# EAGLE design LED-Lamp-2-SMD-50leds (EAGLE 7.6.0)
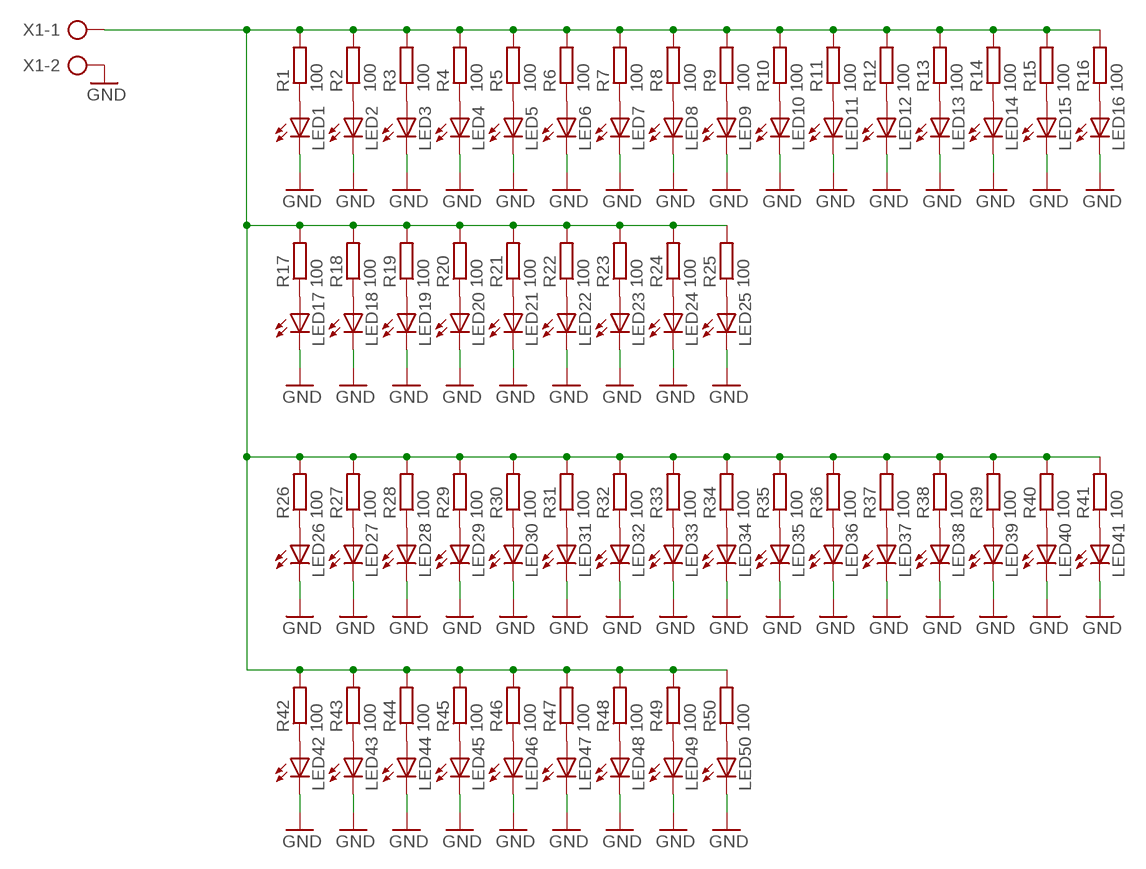
[diagram p0: schematic, sheet 1]

## Parts
LED1  LEDSML0805  [SML0805]
LED2  LEDSML0805  [SML0805]
LED3  LEDSML0805  [SML0805]
LED4  LEDSML0805  [SML0805]
LED5  LEDSML0805  [SML0805]
LED6  LEDSML0805  [SML0805]
LED7  LEDSML0805  [SML0805]
LED8  LEDSML0805  [SML0805]
LED9  LEDSML0805  [SML0805]
LED10  LEDSML0805  [SML0805]
LED11  LEDSML0805  [SML0805]
LED12  LEDSML0805  [SML0805]
LED13  LEDSML0805  [SML0805]
LED14  LEDSML0805  [SML0805]
LED15  LEDSML0805  [SML0805]
LED16  LEDSML0805  [SML0805]
LED17  LEDSML0805  [SML0805]
LED18  LEDSML0805  [SML0805]
LED19  LEDSML0805  [SML0805]
LED20  LEDSML0805  [SML0805]
LED21  LEDSML0805  [SML0805]
LED22  LEDSML0805  [SML0805]
LED23  LEDSML0805  [SML0805]
LED24  LEDSML0805  [SML0805]
LED25  LEDSML0805  [SML0805]
LED26  LEDSML0805  [SML0805]
LED27  LEDSML0805  [SML0805]
LED28  LEDSML0805  [SML0805]
LED29  LEDSML0805  [SML0805]
LED30  LEDSML0805  [SML0805]
LED31  LEDSML0805  [SML0805]
LED32  LEDSML0805  [SML0805]
LED33  LEDSML0805  [SML0805]
LED34  LEDSML0805  [SML0805]
LED35  LEDSML0805  [SML0805]
LED36  LEDSML0805  [SML0805]
LED37  LEDSML0805  [SML0805]
LED38  LEDSML0805  [SML0805]
LED39  LEDSML0805  [SML0805]
LED40  LEDSML0805  [SML0805]
LED41  LEDSML0805  [SML0805]
LED42  LEDSML0805  [SML0805]
LED43  LEDSML0805  [SML0805]
LED44  LEDSML0805  [SML0805]
LED45  LEDSML0805  [SML0805]
LED46  LEDSML0805  [SML0805]
LED47  LEDSML0805  [SML0805]
LED48  LEDSML0805  [SML0805]
LED49  LEDSML0805  [SML0805]
LED50  LEDSML0805  [SML0805]
R1  100  R-EU_M0805  [M0805]
R2  100  R-EU_M0805  [M0805]
R3  100  R-EU_M0805  [M0805]
R4  100  R-EU_M0805  [M0805]
R5  100  R-EU_M0805  [M0805]
R6  100  R-EU_M0805  [M0805]
R7  100  R-EU_M0805  [M0805]
R8  100  R-EU_M0805  [M0805]
R9  100  R-EU_M0805  [M0805]
R10  100  R-EU_M0805  [M0805]
R11  100  R-EU_M0805  [M0805]
R12  100  R-EU_M0805  [M0805]
R13  100  R-EU_M0805  [M0805]
R14  100  R-EU_M0805  [M0805]
R15  100  R-EU_M0805  [M0805]
R16  100  R-EU_M0805  [M0805]
R17  100  R-EU_M0805  [M0805]
R18  100  R-EU_M0805  [M0805]
R19  100  R-EU_M0805  [M0805]
R20  100  R-EU_M0805  [M0805]
R21  100  R-EU_M0805  [M0805]
R22  100  R-EU_M0805  [M0805]
R23  100  R-EU_M0805  [M0805]
R24  100  R-EU_M0805  [M0805]
R25  100  R-EU_M0805  [M0805]
R26  100  R-EU_M0805  [M0805]
R27  100  R-EU_M0805  [M0805]
R28  100  R-EU_M0805  [M0805]
R29  100  R-EU_M0805  [M0805]
R30  100  R-EU_M0805  [M0805]
R31  100  R-EU_M0805  [M0805]
R32  100  R-EU_M0805  [M0805]
R33  100  R-EU_M0805  [M0805]
R34  100  R-EU_M0805  [M0805]
R35  100  R-EU_M0805  [M0805]
R36  100  R-EU_M0805  [M0805]
R37  100  R-EU_M0805  [M0805]
R38  100  R-EU_M0805  [M0805]
R39  100  R-EU_M0805  [M0805]
R40  100  R-EU_M0805  [M0805]
R41  100  R-EU_M0805  [M0805]
R42  100  R-EU_M0805  [M0805]
R43  100  R-EU_M0805  [M0805]
R44  100  R-EU_M0805  [M0805]
R45  100  R-EU_M0805  [M0805]
R46  100  R-EU_M0805  [M0805]
R47  100  R-EU_M0805  [M0805]
R48  100  R-EU_M0805  [M0805]
R49  100  R-EU_M0805  [M0805]
R50  100  R-EU_M0805  [M0805]
X1  AK300/2  [AK300/2]

## Nets
GND: LED1.C LED2.C LED3.C LED4.C LED5.C LED6.C LED7.C LED8.C LED9.C LED10.C LED11.C LED12.C LED13.C LED14.C LED15.C LED16.C LED17.C LED18.C LED19.C LED20.C LED21.C LED22.C LED23.C LED24.C LED25.C LED26.C LED27.C LED28.C LED29.C LED30.C LED31.C LED32.C LED33.C LED34.C LED35.C LED36.C LED37.C LED38.C LED39.C LED40.C LED41.C LED42.C LED43.C LED44.C LED45.C LED46.C LED47.C LED48.C LED49.C LED50.C X1.2
N$1: LED1.A R1.1
N$2: LED26.A R26.1
N$3: LED27.A R27.1
N$4: LED2.A R2.1
N$5: R1.2 R2.2 R3.2 R4.2 R5.2 R6.2 R7.2 R8.2 R9.2 R10.2 R11.2 R12.2 R13.2 R14.2 R15.2 R16.2 R17.2 R18.2 R19.2 R20.2 R21.2 R22.2 R23.2 R24.2 R25.2 R26.2 R27.2 R28.2 R29.2 R30.2 R31.2 R32.2 R33.2 R34.2 R35.2 R36.2 R37.2 R38.2 R39.2 R40.2 R41.2 R42.2 R43.2 R44.2 R45.2 R46.2 R47.2 R48.2 R49.2 R50.2 X1.1
N$6: LED3.A R3.1
N$7: LED28.A R28.1
N$8: LED4.A R4.1
N$9: LED29.A R29.1
N$10: LED5.A R5.1
N$11: LED31.A R31.1
N$12: LED6.A R6.1
N$13: LED30.A R30.1
N$14: LED7.A R7.1
N$15: LED32.A R32.1
N$16: LED8.A R8.1
N$17: LED33.A R33.1
N$18: LED9.A R9.1
N$19: LED34.A R34.1
N$20: LED10.A R10.1
N$21: LED35.A R35.1
N$22: LED11.A R11.1
N$23: LED36.A R36.1
N$24: LED12.A R12.1
N$25: LED37.A R37.1
N$26: LED13.A R13.1
N$27: LED38.A R38.1
N$28: LED14.A R14.1
N$29: LED39.A R39.1
N$30: LED15.A R15.1
N$31: LED41.A R41.1
N$32: LED16.A R16.1
N$33: LED40.A R40.1
N$34: LED17.A R17.1
N$35: LED42.A R42.1
N$36: LED18.A R18.1
N$37: LED43.A R43.1
N$38: LED19.A R19.1
N$39: LED44.A R44.1
N$40: LED20.A R20.1
N$41: LED45.A R45.1
N$42: LED21.A R21.1
N$43: LED46.A R46.1
N$44: LED22.A R22.1
N$45: LED47.A R47.1
N$46: LED23.A R23.1
N$47: LED48.A R48.1
N$48: LED24.A R24.1
N$49: LED49.A R49.1
N$50: LED25.A R25.1
N$51: LED50.A R50.1

## Library data of the parts
LED1-LED50 = led:LED: LED OSRAM: - CHIPLED LG R971, LG N971, LY N971, LG Q971, LY Q971, LO R971, LY R971 LH N974, LH R974 LS Q976, LO Q976, LY Q976 LO Q996 - Hyper CHIPLED LW Q18S LB Q993, LB Q99A, LB R99A - SideLED LS A670, LO A670, LY A670, LG A670, LP A670 LB A673, LV A673, LT A673, LW A673 LH A674 LY A675 LS A676, LA A676, LO A676, LY A676, LW A676 LS A679, LY A679, LG A679 - Hyper Micro SIDELED® LS Y876, LA Y876, LO Y876, LY Y876 LT Y87S - SmartLED LW L88C, LW L88S LB L89C, LB L89S, LG L890 LS L89K, LO L89K, LY L89K LS L896, LA L896, LO L896, LY L896 - TOPLED LS T670, LO T670, LY T670, LG T670, LP T670 LSG T670, LSP T670, LSY T670, LOP T670, LYG T670 LG T671, LOG T671, LSG T671 LB T673, LV T673, LT T673, LW T673 LH T674 LS T676, LA T676, LO T676, LY T676, LB T676, LH T676, LSB T676, LW T676 LB T67C, LV T67C, LT T67C, LS T67K, LO T67K, LY T67K, LW E67C LS E67B, LA E67B, LO E67B, LY E67B, LB E67C, LV E67C, LT E67C LW T67C LS T679, LY T679, LG T679 LS T770, LO T770, LY T770, LG T770, LP T770 LB T773, LV T773, LT T773, LW T773 LH T774 LS E675, LA E675, LY E675, LS T675 LS T776, LA T776, LO T776, LY T776, LB T776 LHGB T686 LT T68C, LB T68C - Hyper Mini TOPLED® LB M676 - Mini TOPLED Santana® LG M470 LS M47K, LO M47K, LY M47K Source: http://www.osram.convergy.de LUXEON: - LUMILED® LXK2-PW12-R00, LXK2-PW12-S00, LXK2-PW14-U00, LXK2-PW14-V00 LXK2-PM12-R00, LXK2-PM12-S00, LXK2-PM14-U00 LXK2-PE12-Q00, LXK2-PE12-R00, LXK2-PE12-S00, LXK2-PE14-T00, LXK2-PE14-U00 LXK2-PB12-K00, LXK2-PB12-L00, LXK2-PB12-M00, LXK2-PB14-N00, LXK2-PB14-P00, LXK2-PB14-Q00 LXK2-PR12-L00, LXK2-PR12-M00, LXK2-PR14-Q00, LXK2-PR14-R00 LXK2-PD12-Q00, LXK2-PD12-R00, LXK2-PD12-S00 LXK2-PH12-R00, LXK2-PH12-S00 LXK2-PL12-P00, LXK2-PL12-Q00, LXK2-PL12-R00 Source: www.luxeon.com KINGBRIGHT: KA-3528ASYC Source: www.kingbright.com
R1-R50 = rcl:R-EU_: RESISTOR, European symbol
X1 = con-ptr500:AK300/2: CONNECTOR; OC_FARNELL: unknown; OC_NEWARK: unknown

## Board
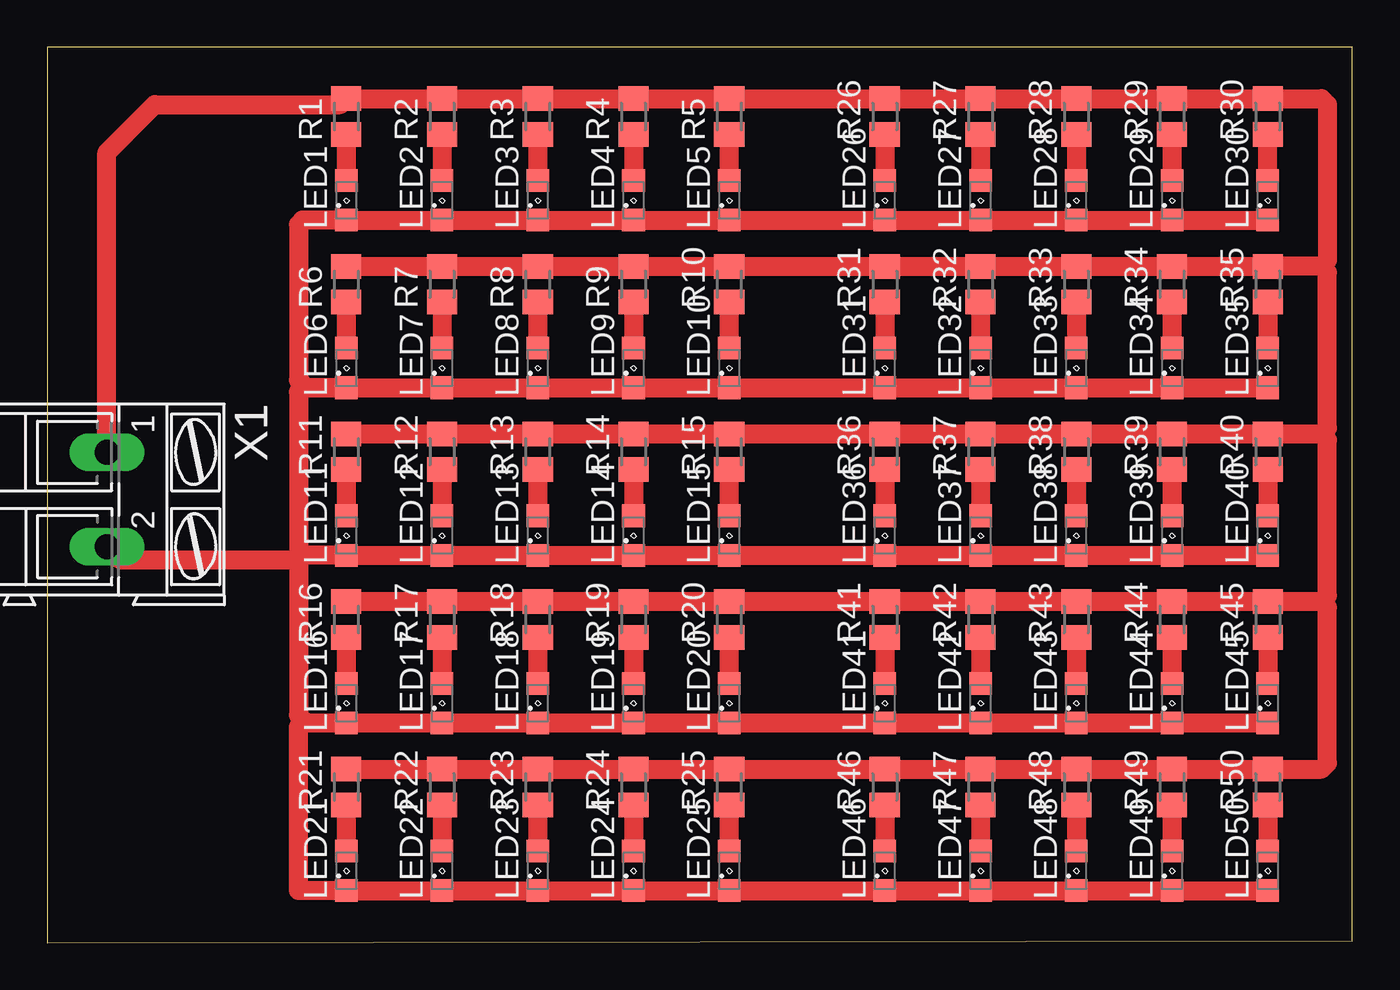
[diagram p1: board, top side]

Size 69.27 x 47.5 mm. Coordinates in mm from the lower left corner, seen from the top.
Outline: 0,0 69.27,0.1 69.27,47.5 0,47.5 0,0
Copper layers (1*16): Top 0.035mm / dielectric 1.5mm / Bottom 0.035mm
Design rules "default": minimum track width 10mil, minimum drill 24mil, track to track 8mil, track to pad 8mil, pad to pad 8mil, via to via 8mil, smd to smd 8mil, copper to edge 40mil, drill to drill 8mil, minimum pad ring 10mil, minimum via ring 8mil, stop-mask expansion 4mil, vias tented up to drill 0mil, thermal gap 10mil

### Footprints (pad centres in the part's own frame; a part is rotated, then mirrored left to right if it is on the bottom)
SML0805 = smd 1.2 x 1.2: A 1.05,0; C -1.05,0
M0805 = smd 1.3 x 1.6: 1 -0.95,0; 2 0.95,0
AK300/2 = drill 1.321 long: 1 -2.515,0; 2 2.489,0

### Placement (x,y rotation side)
LED1  15.88,39.37 90 top
LED2  20.95,39.37 90 top
LED3  26.04,39.37 90 top
LED4  31.11,39.37 90 top
LED5  36.2,39.37 90 top
LED6  15.88,30.48 90 top
LED7  20.95,30.48 90 top
LED8  26.04,30.48 90 top
LED9  31.11,30.48 90 top
LED10  36.2,30.48 90 top
LED11  15.88,21.59 90 top
LED12  20.95,21.59 90 top
LED13  26.04,21.59 90 top
LED14  31.11,21.59 90 top
LED15  36.2,21.59 90 top
LED16  15.88,12.7 90 top
LED17  20.95,12.7 90 top
LED18  26.04,12.7 90 top
LED19  31.11,12.7 90 top
LED20  36.2,12.7 90 top
LED21  15.88,3.81 90 top
LED22  20.95,3.81 90 top
LED23  26.04,3.81 90 top
LED24  31.11,3.81 90 top
LED25  36.2,3.81 90 top
LED26  44.45,39.37 90 top
LED27  49.53,39.37 90 top
LED28  54.61,39.37 90 top
LED29  59.69,39.37 90 top
LED30  64.77,39.37 90 top
LED31  44.45,30.48 90 top
LED32  49.53,30.48 90 top
LED33  54.61,30.48 90 top
LED34  59.69,30.48 90 top
LED35  64.77,30.48 90 top
LED36  44.45,21.59 90 top
LED37  49.53,21.59 90 top
LED38  54.61,21.59 90 top
LED39  59.69,21.59 90 top
LED40  64.77,21.59 90 top
LED41  44.45,12.7 90 top
LED42  49.53,12.7 90 top
LED43  54.61,12.7 90 top
LED44  59.69,12.7 90 top
LED45  64.77,12.7 90 top
LED46  44.45,3.81 90 top
LED47  49.53,3.81 90 top
LED48  54.61,3.81 90 top
LED49  59.69,3.81 90 top
LED50  64.77,3.81 90 top
R1  15.88,43.81 90 top
R2  20.95,43.81 90 top
R3  26.04,43.81 90 top
R4  31.11,43.81 90 top
R5  36.2,43.81 90 top
R6  15.88,34.92 90 top
R7  20.95,34.92 90 top
R8  26.04,34.92 90 top
R9  31.11,34.92 90 top
R10  36.2,34.92 90 top
R11  15.88,26.04 90 top
R12  20.95,26.04 90 top
R13  26.04,26.04 90 top
R14  31.11,26.04 90 top
R15  36.2,26.04 90 top
R16  15.88,17.14 90 top
R17  20.95,17.14 90 top
R18  26.04,17.14 90 top
R19  31.11,17.14 90 top
R20  36.2,17.14 90 top
R21  15.88,8.26 90 top
R22  20.95,8.26 90 top
R23  26.04,8.26 90 top
R24  31.11,8.26 90 top
R25  36.2,8.26 90 top
R26  44.45,43.81 90 top
R27  49.53,43.81 90 top
R28  54.61,43.81 90 top
R29  59.69,43.81 90 top
R30  64.77,43.81 90 top
R31  44.45,34.92 90 top
R32  49.53,34.92 90 top
R33  54.61,34.92 90 top
R34  59.69,34.92 90 top
R35  64.77,34.92 90 top
R36  44.45,26.04 90 top
R37  49.53,26.04 90 top
R38  54.61,26.04 90 top
R39  59.69,26.04 90 top
R40  64.77,26.04 90 top
R41  44.45,17.14 90 top
R42  49.53,17.14 90 top
R43  54.61,17.14 90 top
R44  59.69,17.14 90 top
R45  64.77,17.14 90 top
R46  44.45,8.26 90 top
R47  49.53,8.26 90 top
R48  54.61,8.26 90 top
R49  59.69,8.26 90 top
R50  64.77,8.26 90 top
X1  3.17,23.5 270 top

### Tracks (layer width: path | path; a pad name or v marks a point on that pad's centre or on a via)
GND
  Top 1.016: LED50.C LED49.C LED48.C LED47.C LED46.C LED25.C LED24.C LED23.C LED22.C LED21.C 13.34,2.76 13.34,11.43 13.65,11.75 | LED45.C LED44.C LED43.C LED42.C LED41.C LED20.C LED19.C LED18.C LED17.C LED16.C 13.75,11.65 13.65,11.75 | LED40.C LED39.C LED38.C LED37.C LED36.C LED15.C LED14.C LED13.C LED12.C LED11.C 13.34,20.54 | LED35.C LED34.C LED33.C LED32.C LED31.C LED10.C LED9.C LED8.C LED7.C LED6.C | LED30.C LED29.C LED28.C LED27.C LED26.C LED5.C LED4.C LED3.C LED2.C LED1.C 13.55,38.32 13.34,38.1 13.34,29.84 13.75,29.43 LED6.C | 13.34,20.54 13.34,20.32 | 13.34,20.32 13.34,12.06 13.65,11.75 | LED6.C 13.55,29.43 13.34,29.21 13.34,20.54 | X1.2 3.86,20.32 13.34,20.32
N$1
  Top 1.016: R1.1 LED1.A
N$2
  Top 1.016: R26.1 LED26.A
N$3
  Top 1.016: R27.1 LED27.A
N$4
  Top 1.016: R2.1 LED2.A
N$5
  Top 1.016: R6.2 R7.2 R8.2 R9.2 R10.2 R31.2 R32.2 R33.2 R34.2 R35.2 67.62,35.88 | R11.2 R12.2 R13.2 R14.2 R15.2 R36.2 R37.2 R38.2 R39.2 R40.2 67.62,26.98 | R16.2 R17.2 R18.2 R19.2 R20.2 R41.2 R42.2 R43.2 R44.2 R45.2 67.62,18.09 | R21.2 R22.2 R23.2 R24.2 R25.2 R46.2 R47.2 R48.2 R49.2 R50.2 67.62,9.21 67.94,9.53 67.94,17.77 67.62,18.09 | 67.62,35.88 67.94,36.2 67.94,44.45 67.63,44.77 R30.2 R29.2 R28.2 R27.2 R26.2 R5.2 R4.2 R3.2 R2.2 R1.2 15.56,44.45 5.71,44.45 3.17,41.91 X1.1 | 67.62,26.98 67.94,27.3 67.94,35.55 67.62,35.88 | 67.62,18.09 67.94,18.41 67.94,26.66 67.62,26.98
N$6
  Top 1.016: R3.1 LED3.A
N$7
  Top 1.016: R28.1 LED28.A
N$8
  Top 1.016: R4.1 LED4.A
N$9
  Top 1.016: R29.1 LED29.A
N$10
  Top 1.016: R5.1 LED5.A
N$11
  Top 1.016: R31.1 LED31.A
N$12
  Top 1.016: R6.1 LED6.A
N$13
  Top 1.016: LED30.A R30.1
N$14
  Top 1.016: R7.1 LED7.A
N$15
  Top 1.016: R32.1 LED32.A
N$16
  Top 1.016: R8.1 LED8.A
N$17
  Top 1.016: R33.1 LED33.A
N$18
  Top 1.016: R9.1 LED9.A
N$19
  Top 1.016: R34.1 LED34.A
N$20
  Top 1.016: R10.1 LED10.A
N$21
  Top 1.016: R35.1 LED35.A
N$22
  Top 1.016: R11.1 LED11.A
N$23
  Top 1.016: R36.1 LED36.A
N$24
  Top 1.016: R12.1 LED12.A
N$25
  Top 1.016: R37.1 LED37.A
N$26
  Top 1.016: R13.1 LED13.A
N$27
  Top 1.016: R38.1 LED38.A
N$28
  Top 1.016: R14.1 LED14.A
N$29
  Top 1.016: R39.1 LED39.A
N$30
  Top 1.016: R15.1 LED15.A
N$31
  Top 1.016: R41.1 LED41.A
N$32
  Top 1.016: R16.1 LED16.A
N$33
  Top 1.016: R40.1 LED40.A
N$34
  Top 1.016: R17.1 LED17.A
N$35
  Top 1.016: R42.1 LED42.A
N$36
  Top 1.016: R18.1 LED18.A
N$37
  Top 1.016: R43.1 LED43.A
N$38
  Top 1.016: R19.1 LED19.A
N$39
  Top 1.016: R44.1 LED44.A
N$40
  Top 1.016: R20.1 LED20.A
N$41
  Top 1.016: R45.1 LED45.A
N$42
  Top 1.016: R21.1 LED21.A
N$43
  Top 1.016: R46.1 LED46.A
N$44
  Top 1.016: R22.1 LED22.A
N$45
  Top 1.016: R47.1 LED47.A
N$46
  Top 1.016: R23.1 LED23.A
N$47
  Top 1.016: R48.1 LED48.A
N$48
  Top 1.016: R24.1 LED24.A
N$49
  Top 1.016: R49.1 LED49.A
N$50
  Top 1.016: R25.1 LED25.A
N$51
  Top 1.016: R50.1 LED50.A